# Altium project LPCB278__RLOOP__HE_THERM.PrjPCB
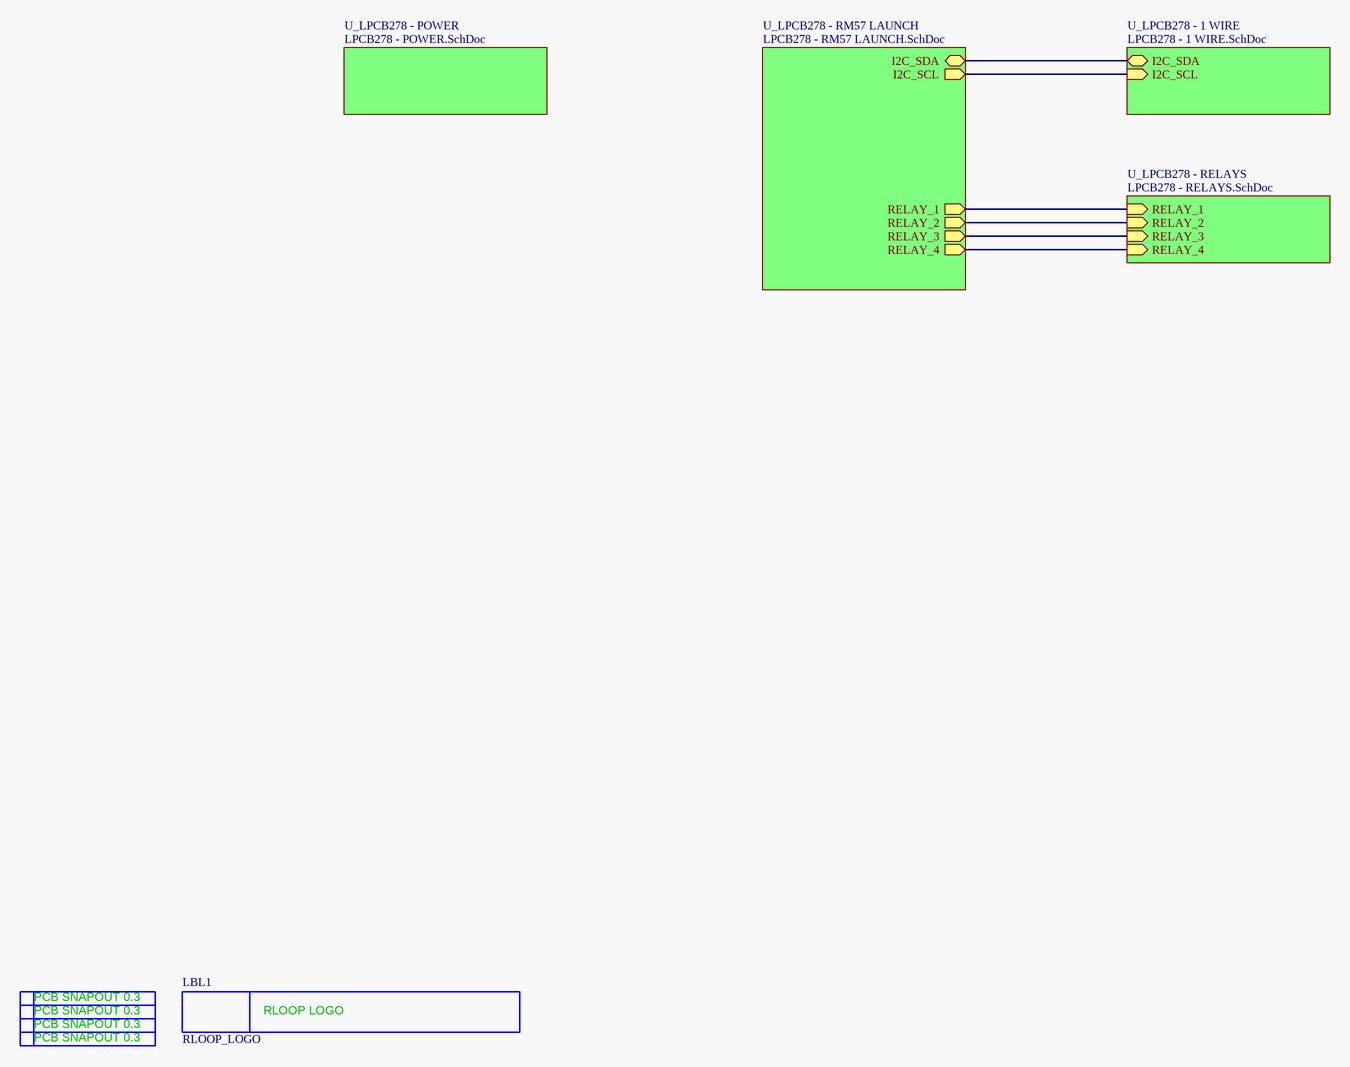
[diagram p0: LPCB278 - TOP.SchDoc]
5 sheets, 67 parts. Net scope: hierarchical (ports join the sheet entries above them; power ports are global).
Board files: LPCB278R0.PcbDoc, LPCB278R0__ASCII.PcbDoc
Sheets:
  LPCB278 - TOP.SchDoc
    U_LPCB278 - 1 WIRE = LPCB278 - 1 WIRE.SchDoc
    U_LPCB278 - POWER = LPCB278 - POWER.SchDoc
    U_LPCB278 - RM57 LAUNCH = LPCB278 - RM57 LAUNCH.SchDoc
    U_LPCB278 - RELAYS = LPCB278 - RELAYS.SchDoc

## Sheet LPCB278 - TOP.SchDoc
size A3; Address1: Factory 10; Address2: 9-13 Dingley Avenue, Dandeong, VICTORIA 3175, AUSTRALIA; DocumentNumber: 1; Revision: 1; SheetNumber: 1; SheetTotal: 5; Lockie__PCB_SUB_ASSEMBLY: PCB Sub Component; Lockie__PCB_ASSEMBLY: PCB Assembly; Lockie__LDL: LPCB278; Lockie__PCB_DESCRIPTION: HE Thermal Module

### Parts
LBL1  RLOOP_LOGO  [RLOOP_LOGO]  (no BOM)
SN1  PCB_SNAPOUT_0.3MM  [PCB_SNAPOUT_0.3MM]  (value not drawn)  (no BOM)
SN2  PCB_SNAPOUT_0.3MM  [PCB_SNAPOUT_0.3MM]  (value not drawn)  (no BOM)
SN3  PCB_SNAPOUT_0.3MM  [PCB_SNAPOUT_0.3MM]  (value not drawn)  (no BOM)
SN4  PCB_SNAPOUT_0.3MM  [PCB_SNAPOUT_0.3MM]  (value not drawn)  (no BOM)

### Sub-sheets
U_LPCB278 - 1 WIRE = LPCB278 - 1 WIRE.SchDoc: I2C_SDA (bidir), I2C_SCL (in)
U_LPCB278 - POWER = LPCB278 - POWER.SchDoc: no entries
U_LPCB278 - RELAYS = LPCB278 - RELAYS.SchDoc: RELAY_1 (in), RELAY_2 (in), RELAY_3 (in), RELAY_4 (in)
U_LPCB278 - RM57 LAUNCH = LPCB278 - RM57 LAUNCH.SchDoc: I2C_SDA (bidir), I2C_SCL (out), RELAY_1 (out), RELAY_2 (out), RELAY_3 (out), RELAY_4 (out)

### Nets
I2C_SCL: sheet U_LPCB278 - 1 WIRE/I2C_SCL, sheet U_LPCB278 - RM57 LAUNCH/I2C_SCL
I2C_SDA: sheet U_LPCB278 - 1 WIRE/I2C_SDA, sheet U_LPCB278 - RM57 LAUNCH/I2C_SDA
RELAY_1: sheet U_LPCB278 - RM57 LAUNCH/RELAY_1, sheet U_LPCB278 - RELAYS/RELAY_1
RELAY_2: sheet U_LPCB278 - RM57 LAUNCH/RELAY_2, sheet U_LPCB278 - RELAYS/RELAY_2
RELAY_3: sheet U_LPCB278 - RM57 LAUNCH/RELAY_3, sheet U_LPCB278 - RELAYS/RELAY_3
RELAY_4: sheet U_LPCB278 - RM57 LAUNCH/RELAY_4, sheet U_LPCB278 - RELAYS/RELAY_4

### Notes on the sheet
- PCB COMPONENT DESCRIPTION
- LDL NUMBER
- Assembly Details
- Size
- Drawing File Name
- Revision
- http://rloop.org
- Scale
- A3
- Sheet Details
- N.T.S
- Sheet:
- Of:
- (in symbol PCB_SNAPOUT_0.3MM) PCB SNAPOUT 0.3
- (in symbol RLOOP_LOGO) RLOOP LOGO

### Library data of the parts
LBL1 = RLOOP_LOGO: FMEDA__CHANNEL: DIAG; FMEDA__FUNCTION_IN_SYSTEM: *
SN1-SN4 = PCB_SNAPOUT_0.3MM: PCB Snapout + 0.3mm; FMEDA__CHANNEL: DIAG; FMEDA__FUNCTION_IN_SYSTEM: *

## Sheet LPCB278 - 1 WIRE.SchDoc
size A3; Address1: Factory 10; Address2: 9-13 Dingley Avenue, Dandeong, VICTORIA 3175, AUSTRALIA; DocumentNumber: 2; Revision: 1; SheetNumber: 2; SheetTotal: 5; Lockie__PCB_SUB_ASSEMBLY: PCB Sub Component; Lockie__PCB_ASSEMBLY: PCB Assembly; Lockie__LDL: LPCB278; Lockie__PCB_DESCRIPTION: HE Thermal Module
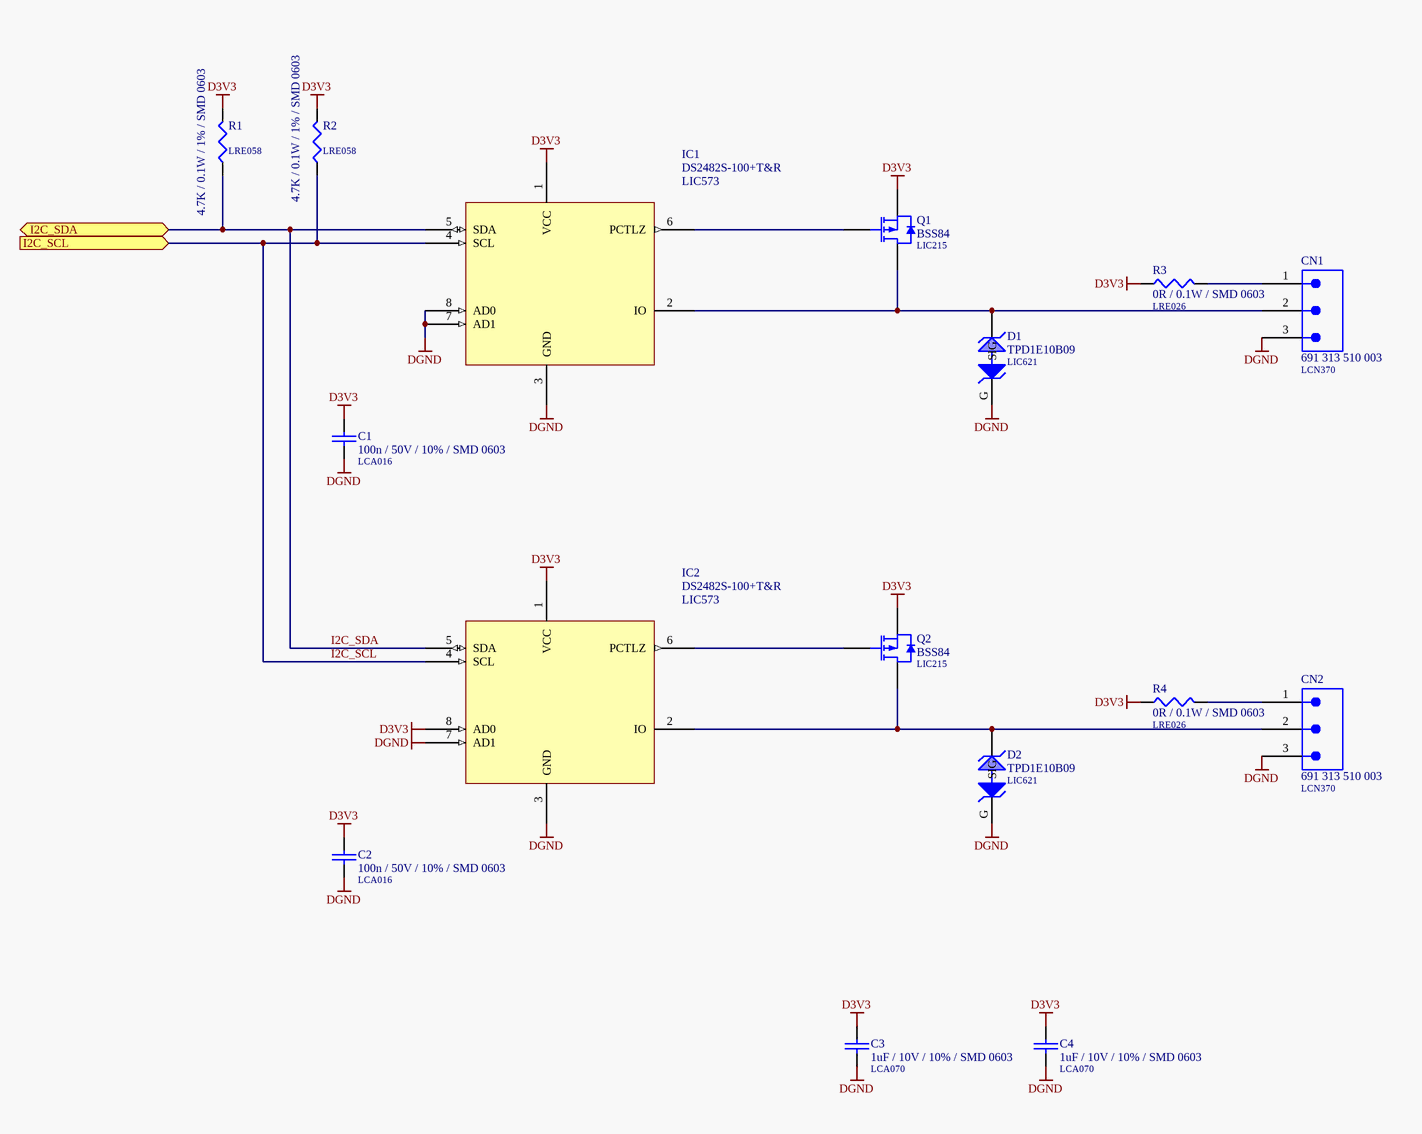
[diagram p1: LPCB278 - 1 WIRE.SchDoc]

### Parts
C1  100n / 50V / 10% / SMD 0603  LDL_NUMBER: LCA016  [LFP011__CC1608-0603-IPC7351_B]
C2  100n / 50V / 10% / SMD 0603  LDL_NUMBER: LCA016  [LFP011__CC1608-0603-IPC7351_B]
C3  1uF / 10V / 10% / SMD 0603  LDL_NUMBER: LCA070  [LFP011__CC1608-0603-IPC7351_B]
C4  1uF / 10V / 10% / SMD 0603  LDL_NUMBER: LCA070  [LFP011__CC1608-0603-IPC7351_B]
CN1  691 313 510 003  LDL_NUMBER: LCN370  [691 313 510 003]
CN2  691 313 510 003  LDL_NUMBER: LCN370  [691 313 510 003]
D1  TPD1E10B09  LDL_NUMBER: LIC621  [LFP157__R-PX1SON-N2]
D2  TPD1E10B09  LDL_NUMBER: LIC621  [LFP157__R-PX1SON-N2]
IC1  DS2482S-100+T&R  LDL_NUMBER: LIC573  [LFP069__R-8G]
IC2  DS2482S-100+T&R  LDL_NUMBER: LIC573  [LFP069__R-8G]
Q1  BSS84  LDL_NUMBER: LIC215  [LFP021__SOT23]
Q2  BSS84  LDL_NUMBER: LIC215  [LFP021__SOT23]
R1  4.7K / 0.1W / 1% / SMD 0603  LDL_NUMBER: LRE058  [LFP020__CR1608-0603-IPC7351_B]
R2  4.7K / 0.1W / 1% / SMD 0603  LDL_NUMBER: LRE058  [LFP020__CR1608-0603-IPC7351_B]
R3  0R / 0.1W / SMD 0603  LDL_NUMBER: LRE026  [LFP020__CR1608-0603-IPC7351_B]
R4  0R / 0.1W / SMD 0603  LDL_NUMBER: LRE026  [LFP020__CR1608-0603-IPC7351_B]

### Ports
I2C_SCL (in), I2C_SDA (bidir)

### Nets
D3V3: C1.1 C2.1 C3.1 C4.1 IC1.1(VCC) IC2.1(VCC) IC2.8(AD0) Q1.2(S) Q2.2(S) R1.2 R2.2 R3.1 R4.1
DGND: C1.2 C2.2 C3.2 C4.2 CN1.3 CN2.3 D1.G D2.G IC1.3(GND) IC1.7(AD1) IC1.8(AD0) IC2.3(GND) IC2.7(AD1)
I2C_SCL: IC1.4(SCL) IC2.4(SCL) R2.1 ; port I2C_SCL
I2C_SDA: IC1.5(SDA) IC2.5(SDA) R1.1 ; port I2C_SDA
NetCN1_1: CN1.1 R3.2
NetCN1_2: CN1.2 D1.2(SIG) IC1.2(IO) Q1.3(D)
NetCN2_1: CN2.1 R4.2
NetCN2_2: CN2.2 D2.2(SIG) IC2.2(IO) Q2.3(D)
NetIC1_6: IC1.6(PCTLZ) Q1.1(G)
NetIC2_6: IC2.6(PCTLZ) Q2.1(G)

### Notes on the sheet
- PCB COMPONENT DESCRIPTION
- LDL NUMBER
- Assembly Details
- Size
- Drawing File Name
- Revision
- http://rloop.org
- Scale
- A3
- Sheet Details
- N.T.S
- Sheet:
- Of:

### Library data of the parts
C1 C2 = 100n / 50V / 10% / SMD 0603: Capacitor, Ceramic Chip, 100nF (0.1uF), 50V, 5%, SMD 0603 [LCA016]; FMEDA__OPERATING__VOLTAGE_MIN: 0; FMEDA__OPERATING__VOLTAGE_MAX: 3.3; FMEDA__OPERATING__TEMP_MIN: -20; FMEDA__OPERATING__TEMP_TYP: 27; FMEDA__OPERATING__TEMP_MAX: 50; FMEDA__CHANNEL: COM; Value: 100n; FMEDA__FUNCTION_IN_SYSTEM: *; FMEDA__OPERATING__VOLTAGE_TYP: 3.3
C3 C4 = 1uF / 10V / 10% / SMD 0603: Capacitor, Ceramic Chip, 1uF, 10V, SMD 0603 [LCA070]; Value: 1u; FMEDA__OPERATING__VOLTAGE_MAX: 3.3; FMEDA__OPERATING__VOLTAGE_MIN: 0; FMEDA__OPERATING__TEMP_MAX: 50; FMEDA__OPERATING__TEMP_MIN: -20; FMEDA__OPERATING__TEMP_TYP: 27; FMEDA__CHANNEL: COM; FMEDA__OPERATING__VOLTAGE_TYP: 3.3; FMEDA__FUNCTION_IN_SYSTEM: *
CN1 CN2 = 691 313 510 003: Connector, Pluggable Terminal Block, 5.08mm, 3 Way, PTH; FMEDA__CHANNEL: COM; FMEDA__OPERATING__CURRENT_MAX: 0; FMEDA__OPERATING__TEMP_MAX: 50; FMEDA__OPERATING__TEMP_MIN: -20; FMEDA__OPERATING__TEMP_TYP: 27; FMEDA__OPERATING__VOLTAGE_MAX: 16; FMEDA__OPERATING__VOLTAGE_TYP: 12; FMEDA__FUNCTION_IN_SYSTEM: *; FMEDA__OPERATING__CURRENT_MIN: 0; FMEDA__OPERATING__CURRENT_TYP: 0; FMEDA__OPERATING__VOLTAGE_MIN: 0
D1 D2 = TPD1E10B09: Diode, ESD Protecion, 10pF, 9V Breakdown, SMD 0402 [LIC621]; FMEDA__OPERATING__TEMP_MAX: 50; FMEDA__OPERATING__TEMP_MIN: -20; FMEDA__OPERATING__TEMP_TYP: 27; FMEDA__OPERATING__VOLTAGE_MAX: 0; FMEDA__CHANNEL: COM; FMEDA__FUNCTION_IN_SYSTEM: *; FMEDA__OPERATING__VOLTAGE_MIN: 0; FMEDA__OPERATING__VOLTAGE_TYP: 0; FMEDA__OPERATING__CURRENT_MAX: 0; FMEDA__OPERATING__CURRENT_MIN: 0; FMEDA__OPERATING__CURRENT_TYP: 0
IC1 IC2 = DS2482S-100+T&R: IC, I2C to 1 Wire Bridge, SMD SOIC8
Q1 Q2 = BSS84: FET, P Channel, Logic Level, SMD SOT23 [LIC215]; FMEDA__OPERATING__TEMP_MAX: 50; FMEDA__OPERATING__TEMP_MIN: -20; FMEDA__OPERATING__TEMP_TYP: 27; FMEDA__CHANNEL: COM
R1 R2 = 4.7K / 0.1W / 1% / SMD 0603: Resistor, Ceramic Chip, 4K7, 0.1W, 1%, SMD 0603 [LRE058]; FMEDA__OPERATING__POWER_MAX: 0; FMEDA__OPERATING__TEMP_MAX: 50; FMEDA__OPERATING__TEMP_MIN: -20; FMEDA__OPERATING__TEMP_TYP: 27; FMEDA__CHANNEL: COM; VALUE: 4.7K; FMEDA__OPERATING__POWER_MIN: 0; FMEDA__OPERATING__VOLTAGE_MAX: 0; FMEDA__OPERATING__VOLTAGE_MIN: 0; FMEDA__OPERATING__VOLTAGE_TYP: 0; FMEDA__FUNCTION_IN_SYSTEM: *
R3 R4 = 0R / 0.1W / SMD 0603: Resistor, Ceramic Chip, 0R, 0.1W, SMD 0603 [LRE026]; Value: 0; FMEDA__OPERATING__TEMP_MAX: 50; FMEDA__OPERATING__TEMP_MIN: -20; FMEDA__OPERATING__TEMP_TYP: 27; FMEDA__CHANNEL: COM; FMEDA__OPERATING__POWER_MAX: 0; FMEDA__OPERATING__POWER_MIN: 0; FMEDA__OPERATING__VOLTAGE_MAX: 0; FMEDA__OPERATING__VOLTAGE_MIN: 0; FMEDA__OPERATING__VOLTAGE_TYP: 0; FMEDA__FUNCTION_IN_SYSTEM: *

## Sheet LPCB278 - POWER.SchDoc
size A3; Address1: Factory 10; Address2: 9-13 Dingley Avenue, Dandeong, VICTORIA 3175, AUSTRALIA; DocumentNumber: 3; Revision: 1; SheetNumber: 3; SheetTotal: 5; Lockie__PCB_SUB_ASSEMBLY: PCB Sub Component; Lockie__PCB_ASSEMBLY: PCB Assembly; Lockie__LDL: LPCB278; Lockie__PCB_DESCRIPTION: HE Thermal Module
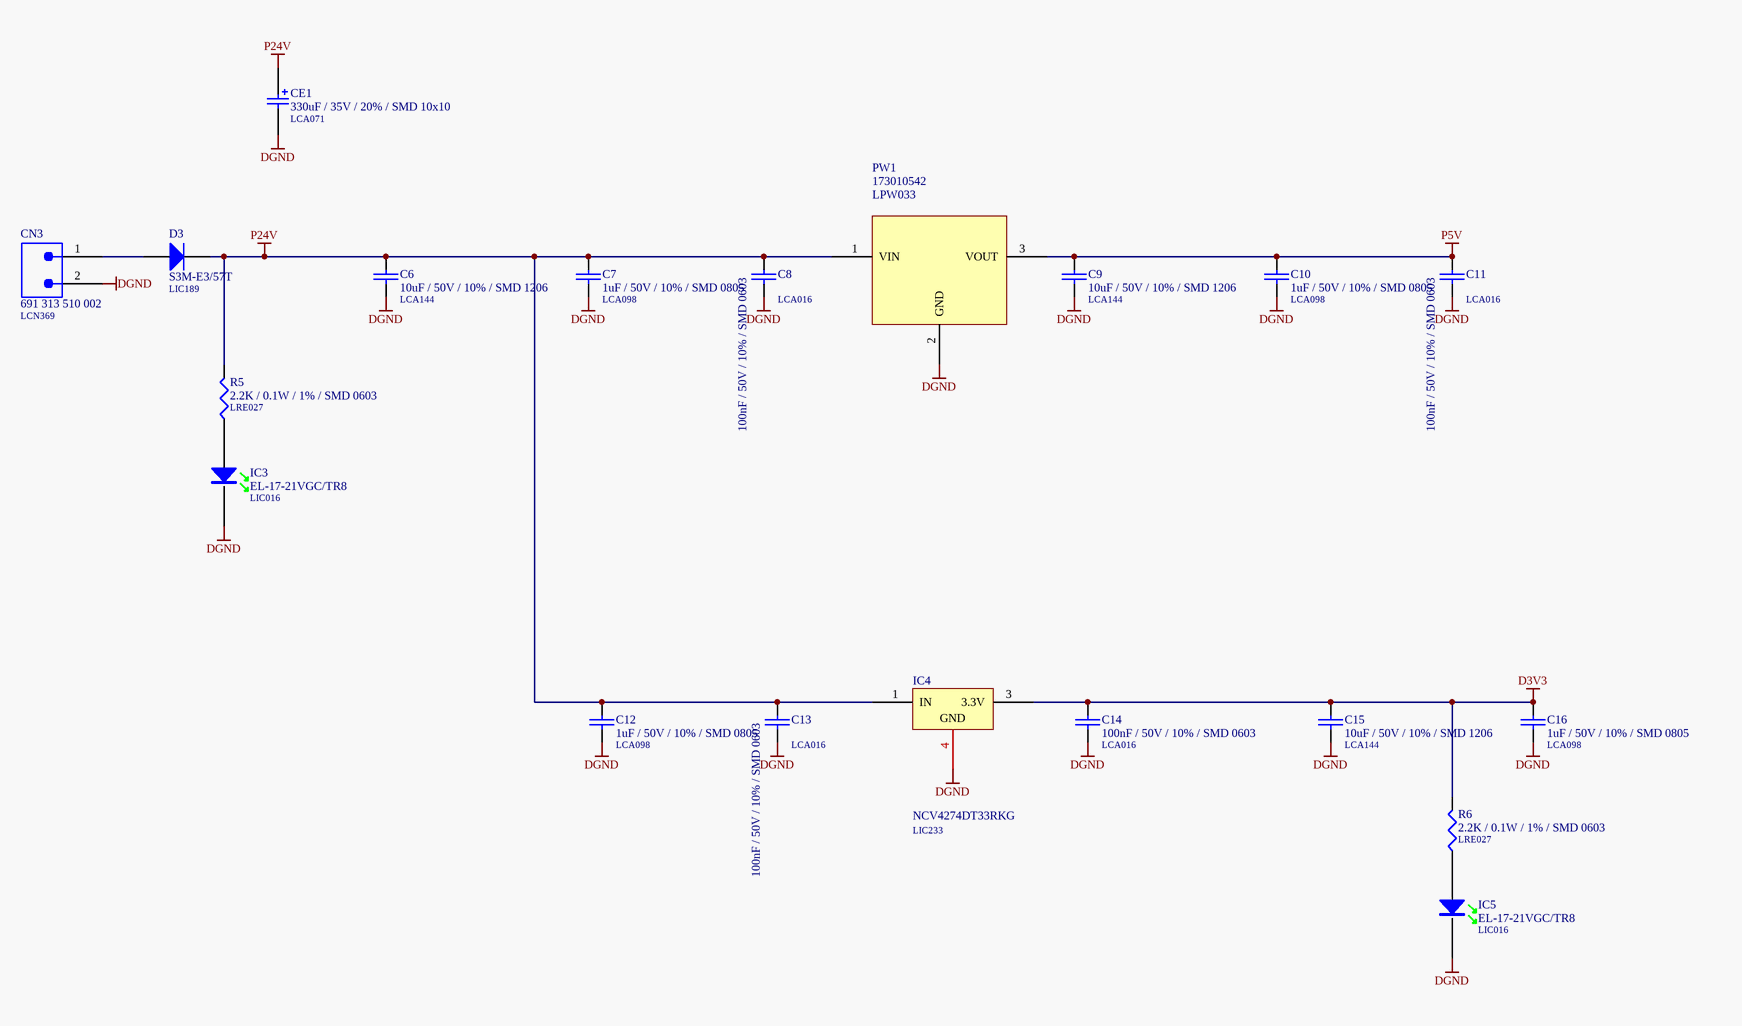
[diagram p2: LPCB278 - POWER.SchDoc]

### Parts
C6  10uF / 50V / 10% / SMD 1206  LDL_NUMBER: LCA144  [LFP043__CC3216-1206]
C7  1uF / 50V / 10% / SMD 0805  LDL_NUMBER: LCA098  [LFP010__CC2012-0805-IPC7351_B]
C8  100nF / 50V / 10% / SMD 0603  LDL_NUMBER: LCA016  [LFP011__CC1608-0603-IPC7351_B]
C9  10uF / 50V / 10% / SMD 1206  LDL_NUMBER: LCA144  [LFP043__CC3216-1206]
C10  1uF / 50V / 10% / SMD 0805  LDL_NUMBER: LCA098  [LFP010__CC2012-0805-IPC7351_B]
C11  100nF / 50V / 10% / SMD 0603  LDL_NUMBER: LCA016  [LFP011__CC1608-0603-IPC7351_B]
C12  1uF / 50V / 10% / SMD 0805  LDL_NUMBER: LCA098  [LFP010__CC2012-0805-IPC7351_B]
C13  100nF / 50V / 10% / SMD 0603  LDL_NUMBER: LCA016  [LFP011__CC1608-0603-IPC7351_B]
C14  100nF / 50V / 10% / SMD 0603  LDL_NUMBER: LCA016  [LFP011__CC1608-0603-IPC7351_B]
C15  10uF / 50V / 10% / SMD 1206  LDL_NUMBER: LCA144  [LFP043__CC3216-1206]
C16  1uF / 50V / 10% / SMD 0805  LDL_NUMBER: LCA098  [LFP010__CC2012-0805-IPC7351_B]
CE1  330uF / 35V / 20% / SMD 10x10  LDL_NUMBER: LCA071  [LFP041__NICHICON_WT_10X10]
CN3  691 313 510 002  LDL_NUMBER: LCN369  [691 313 510 002]
D3  S3M-E3/57T  LDL_NUMBER: LIC189  [LFP040__DO-214AB]
IC3  EL-17-21VGC/TR8  LDL_NUMBER: LIC016  [CR2012-0805-LED]
IC4  NCV4274DT33RKG  LDL_NUMBER: LIC233  [LFP019__369A-13]
IC5  EL-17-21VGC/TR8  LDL_NUMBER: LIC016  [CR2012-0805-LED]
PW1  173010542  LDL_NUMBER: LPW033  [173010542]
R5  2.2K / 0.1W / 1% / SMD 0603  LDL_NUMBER: LRE027  [LFP020__CR1608-0603-IPC7351_B]
R6  2.2K / 0.1W / 1% / SMD 0603  LDL_NUMBER: LRE027  [LFP020__CR1608-0603-IPC7351_B]

### Nets
D3V3: C14.1 C15.1 C16.1 IC4.3(3.3V) R6.2
DGND: C6.2 C7.2 C8.2 C9.2 C10.2 C11.2 C12.2 C13.2 C14.2 C15.2 C16.2 CE1.2 CN3.2 IC3.K IC4.4(GND) IC5.K PW1.2(GND)
P5V: C9.1 C10.1 C11.1 PW1.3(VOUT)
P24V: C6.1 C7.1 C8.1 C12.1 C13.1 CE1.1 D3.1(K) IC4.1(IN) PW1.1(VIN) R5.2
NetCN3_1: CN3.1 D3.2(A)
NetIC3_A: IC3.A R5.1
NetIC5_A: IC5.A R6.1

### Notes on the sheet
- PCB COMPONENT DESCRIPTION
- LDL NUMBER
- Assembly Details
- Size
- Drawing File Name
- Revision
- http://rloop.org
- Scale
- A3
- Sheet Details
- N.T.S
- Sheet:
- Of:

### Library data of the parts
C6 C9 C15 = 10uF / 50V / 10% / SMD 1206: Capacitor, Ceramic Chip, 10uF, 50V, X5R, 10%, SMD 1206 [LCA144]; Value: 10u; FMEDA__OPERATING__TEMP_MAX: 85; FMEDA__OPERATING__TEMP_MIN: -55; FMEDA__OPERATING__TEMP_TYP: 27; FMEDA__OPERATING__VOLTAGE_MAX: 50; FMEDA__OPERATING__VOLTAGE_MIN: 0; FMEDA__CHANNEL: COM; FMEDA__FUNCTION_IN_SYSTEM: *
C7 C10 C12 C16 = 1uF / 50V / 10% / SMD 0805: Capacitor, Ceramic Chip, 1uF, 50V, SMD 0805 [LCA098]; Value: 1u; FMEDA__OPERATING__VOLTAGE_MAX: 3.3; FMEDA__OPERATING__VOLTAGE_MIN: 0; FMEDA__OPERATING__TEMP_MAX: 50; FMEDA__OPERATING__TEMP_MIN: -20; FMEDA__OPERATING__TEMP_TYP: 27; FMEDA__CHANNEL: COM; FMEDA__OPERATING__VOLTAGE_TYP: 3.3; FMEDA__FUNCTION_IN_SYSTEM: *
C8 C11 C13 C14 = 100nF / 50V / 10% / SMD 0603: Capacitor, Ceramic Chip, 100nF (0.1uF), 50V, 5%, SMD 0603 [LCA016]; Value: 100n; FMEDA__OPERATING__VOLTAGE_MIN: 0; FMEDA__OPERATING__VOLTAGE_MAX: 3.3; FMEDA__OPERATING__TEMP_MIN: -20; FMEDA__OPERATING__TEMP_TYP: 27; FMEDA__OPERATING__TEMP_MAX: 50; FMEDA__CHANNEL: COM; FMEDA__FUNCTION_IN_SYSTEM: *; FMEDA__OPERATING__VOLTAGE_TYP: 3.3
CE1 = 330uF / 35V / 20% / SMD 10x10: Capacitor, Aluminum Electrolytic, 330uF, 35V, 20%, SMD (10mm x 10mm) [LCA071]; FMEDA__OPERATING__TEMP_MAX: 50; FMEDA__OPERATING__TEMP_MIN: -20; FMEDA__OPERATING__TEMP_TYP: 27; FMEDA__OPERATING__VOLTAGE_MAX: 0; Value: 330u; FMEDA__CHANNEL: COM; FMEDA__OPERATING__VOLTAGE_MIN: 0; FMEDA__OPERATING__VOLTAGE_TYP: 0; FMEDA__FUNCTION_IN_SYSTEM: *
CN3 = 691 313 510 002: Connector, Pluggable Terminal Block, 5.08mm, 2 Way, PTH; FMEDA__CHANNEL: COM; FMEDA__OPERATING__CURRENT_MAX: 0; FMEDA__OPERATING__TEMP_MAX: 50; FMEDA__OPERATING__TEMP_MIN: -20; FMEDA__OPERATING__TEMP_TYP: 27; FMEDA__OPERATING__VOLTAGE_MAX: 16; FMEDA__OPERATING__VOLTAGE_TYP: 12; FMEDA__FUNCTION_IN_SYSTEM: *; FMEDA__OPERATING__CURRENT_MIN: 0; FMEDA__OPERATING__CURRENT_TYP: 0; FMEDA__OPERATING__VOLTAGE_MIN: 0
D3 = S3M-E3/57T: Diode, General Purpose Rectifier, 3A, 200V, SMD DO-214AB [LIC189]; FMEDA__OPERATING__CURRENT_MAX: 0; FMEDA__OPERATING__TEMP_MAX: 50; FMEDA__OPERATING__TEMP_MIN: -20; FMEDA__OPERATING__TEMP_TYP: 27; FMEDA__CHANNEL: COM; FMEDA__OPERATING__CURRENT_MIN: 0; FMEDA__OPERATING__CURRENT_TYP: 0; FMEDA__OPERATING__VOLTAGE_MAX: 0; FMEDA__OPERATING__VOLTAGE_MIN: 0; FMEDA__OPERATING__VOLTAGE_TYP: 0; FMEDA__FUNCTION_IN_SYSTEM: *
IC3 IC5 = EL-17-21VGC/TR8: LED, SMD, 0805 Green [LIC016]; FMEDA__OPERATING__TEMP_MAX: 50; FMEDA__OPERATING__TEMP_MIN: -20; FMEDA__OPERATING__TEMP_TYP: 27; FMEDA__CHANNEL: COM; FMEDA__FUNCTION_IN_SYSTEM: *
IC4 = NCV4274DT33RKG: IC, Voltage Regulator, 400mA, 3.3V LDO, SMD DPAK [LIC233]; FMEDA__OPERATING__OUTPUT_CURRENT_MIN: 0; FMEDA__OPERATING__TEMP_MAX: 50; FMEDA__OPERATING__TEMP_MIN: -20; FMEDA__OPERATING__TEMP_TYP: 27; VALUE: 0; Note: Obey Thermal Design Rules; FMEDA__CHANNEL: COM; FMEDA__OPERATING__OUTPUT_CURRENT_TYP: 0; FMEDA__OPERATING__VOLTAGE_MAX: 0; FMEDA__OPERATING__VOLTAGE_MIN: 0; FMEDA__OPERATING__VOLTAGE_TYP: 0; FMEDA__FUNCTION_IN_SYSTEM: *
R5 R6 = 2.2K / 0.1W / 1% / SMD 0603: Resistor, Ceramic Chip, 2.2K, 0.1W, 1%, SMD 0603 [LRE027]; FMEDA__OPERATING__VOLTAGE_MIN: 0; FMEDA__OPERATING__TEMP_MIN: -20; FMEDA__OPERATING__TEMP_TYP: 27; FMEDA__OPERATING__TEMP_MAX: 50; FMEDA__CHANNEL: COM; VALUE: 2.2K; FMEDA__OPERATING__VOLTAGE_MAX: 0; FMEDA__OPERATING__POWER_MIN: 0; FMEDA__OPERATING__POWER_MAX: 0; FMEDA__FUNCTION_IN_SYSTEM: *; FMEDA__OPERATING__VOLTAGE_TYP: 0

## Sheet LPCB278 - RM57 LAUNCH.SchDoc
size A3; Address1: Factory 10; Address2: 9-13 Dingley Avenue, Dandeong, VICTORIA 3175, AUSTRALIA; DocumentNumber: 5; Revision: 1; SheetNumber: 5; SheetTotal: 5; Lockie__PCB_SUB_ASSEMBLY: PCB Sub Component; Lockie__PCB_ASSEMBLY: PCB Assembly; Lockie__LDL: LPCB278; Lockie__PCB_DESCRIPTION: HE Thermal Module
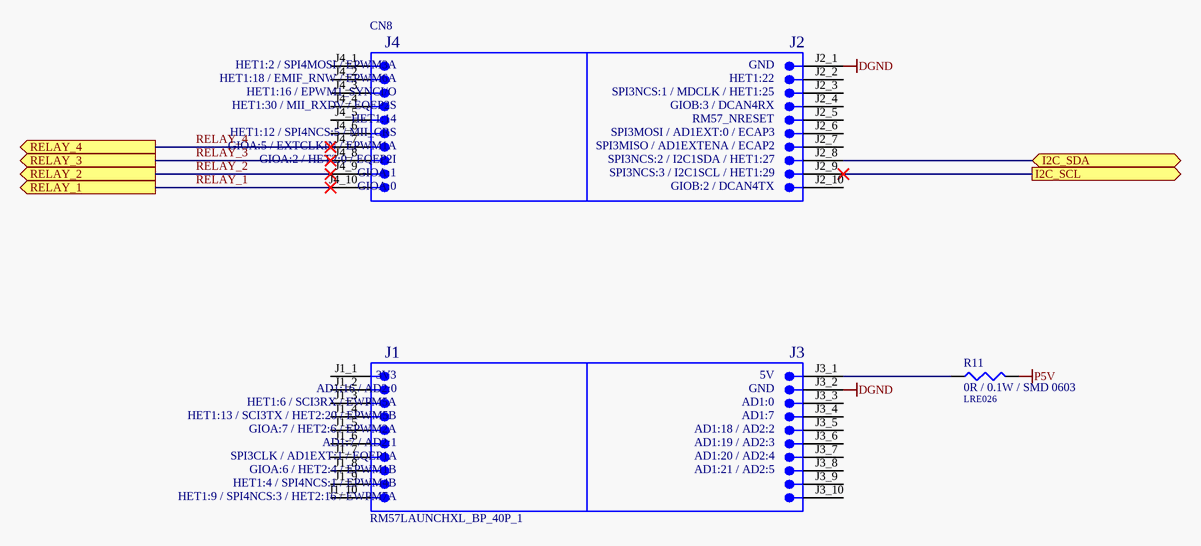
[diagram p3: LPCB278 - RM57 LAUNCH.SchDoc]

### Parts
CN8  RM57LAUNCHXL_BP_40P_1  [RM57LAUNCHXL_BP_40P_1]  (no BOM)
R11  0R / 0.1W / SMD 0603  LDL_NUMBER: LRE026  [LFP020__CR1608-0603-IPC7351_B]

### Ports
I2C_SCL (out), I2C_SDA (bidir), RELAY_1 (out), RELAY_2 (out), RELAY_3 (out), RELAY_4 (out)

### Nets
DGND: CN8.J2_1 CN8.J3_2
P5V: R11.2
I2C_SCL: CN8.J2_9 ; port I2C_SCL
I2C_SDA: CN8.J2_8 ; port I2C_SDA
RELAY_1: CN8.J4_10 ; port RELAY_1
RELAY_2: CN8.J4_9 ; port RELAY_2
RELAY_3: CN8.J4_8 ; port RELAY_3
RELAY_4: CN8.J4_7 ; port RELAY_4
NetCN8_J3_1: CN8.J3_1 R11.1

Not connected (* = marked no-connect by the designer): CN8 J1_1 J1_2 J1_3 J1_4 J1_5 J1_6 J1_7 J1_8 J1_9 J1_10 J2_2 J2_3 J2_4 J2_5 J2_6 J2_7 J2_10 J3_3 J3_4 J3_5 J3_6 J3_7 J3_8 J3_9 J3_10 J4_1 J4_2 J4_3 J4_4 J4_5 J4_6

### Notes on the sheet
- PCB COMPONENT DESCRIPTION
- LDL NUMBER
- Assembly Details
- Size
- Drawing File Name
- Revision
- http://rloop.org
- Scale
- A3
- Sheet Details
- N.T.S
- Sheet:
- Of:
- (in symbol RM57LAUNCHXL_BP_40P_1) J4; J2; HET1:2 / SPI4MOSI / EPWM3A; GND; HET1:18 / EMIF_RNW / EPWM6A; HET1:22; HET1:16 / EPWM1_SYNCI/O; SPI3NCS:1 / MDCLK / HET1:25; HET1:30 / MII_RXDV / EQEP2S; GIOB:3 / DCAN4RX; HET1:14; RM57_NRESET; HET1:12 / SPI4NCS:5 / MII_CRS; SPI3MOSI / AD1EXT:0 / ECAP3; GIOA:5 / EXTCLKIN / EPWM1A; SPI3MISO / AD1EXTENA / ECAP2; GIOA:2 / HET2:0 / EQEP2I; SPI3NCS:2 / I2C1SDA / HET1:27; GIOA:1; SPI3NCS:3 / I2C1SCL / HET1:29; GIOA:0; GIOB:2 / DCAN4TX; J1; J3; 3V3; 5V; AD1:16 / AD2:0; HET1:6 / SCI3RX / EWPM5A; AD1:0; HET1:13 / SCI3TX / HET2:20 / EPWM5B; AD1:7; GIOA:7 / HET2:6 / EPWM2A; AD1:18 / AD2:2; AD1:7 / AD2:1; AD1:19 / AD2:3; SPI3CLK / AD1EXT:1 / EQEP1A; AD1:20 / AD2:4; GIOA:6 / HET2:4 / EPWM1B; AD1:21 / AD2:5; HET1:4 / SPI4NCS:1 / EPWM4B; HET1:9 / SPI4NCS:3 / HET2:16 / EWPM7A

### Library data of the parts
CN8 = RM57LAUNCHXL_BP_40P_1: Connector, RM57L843 LaunchXL, 40Pin Boosterpack Site1; FMEDA__CHANNEL: COM; FMEDA__OPERATING__CURRENT_MAX: 0; FMEDA__OPERATING__TEMP_MAX: 50; FMEDA__OPERATING__TEMP_MIN: -20; FMEDA__OPERATING__TEMP_TYP: 27; FMEDA__OPERATING__VOLTAGE_MAX: 16; FMEDA__OPERATING__VOLTAGE_TYP: 12; FMEDA__FUNCTION_IN_SYSTEM: *; FMEDA__OPERATING__CURRENT_MIN: 0; FMEDA__OPERATING__CURRENT_TYP: 0; FMEDA__OPERATING__VOLTAGE_MIN: 0
R11 = 0R / 0.1W / SMD 0603: as R3 on sheet LPCB278 - 1 WIRE; FMEDA__OPERATING__POWER_MAX: 0; FMEDA__OPERATING__POWER_MIN: 0; FMEDA__OPERATING__VOLTAGE_MAX: 0; FMEDA__OPERATING__VOLTAGE_MIN: 0; FMEDA__OPERATING__VOLTAGE_TYP: 0; FMEDA__FUNCTION_IN_SYSTEM: *

## Sheet LPCB278 - RELAYS.SchDoc
size A3; Address1: Factory 10; Address2: 9-13 Dingley Avenue, Dandeong, VICTORIA 3175, AUSTRALIA; DocumentNumber: 4; Revision: 1; SheetNumber: 4; SheetTotal: 5; Lockie__PCB_SUB_ASSEMBLY: PCB Sub Component; Lockie__PCB_ASSEMBLY: PCB Assembly; Lockie__LDL: LPCB278; Lockie__PCB_DESCRIPTION: HE Thermal Module
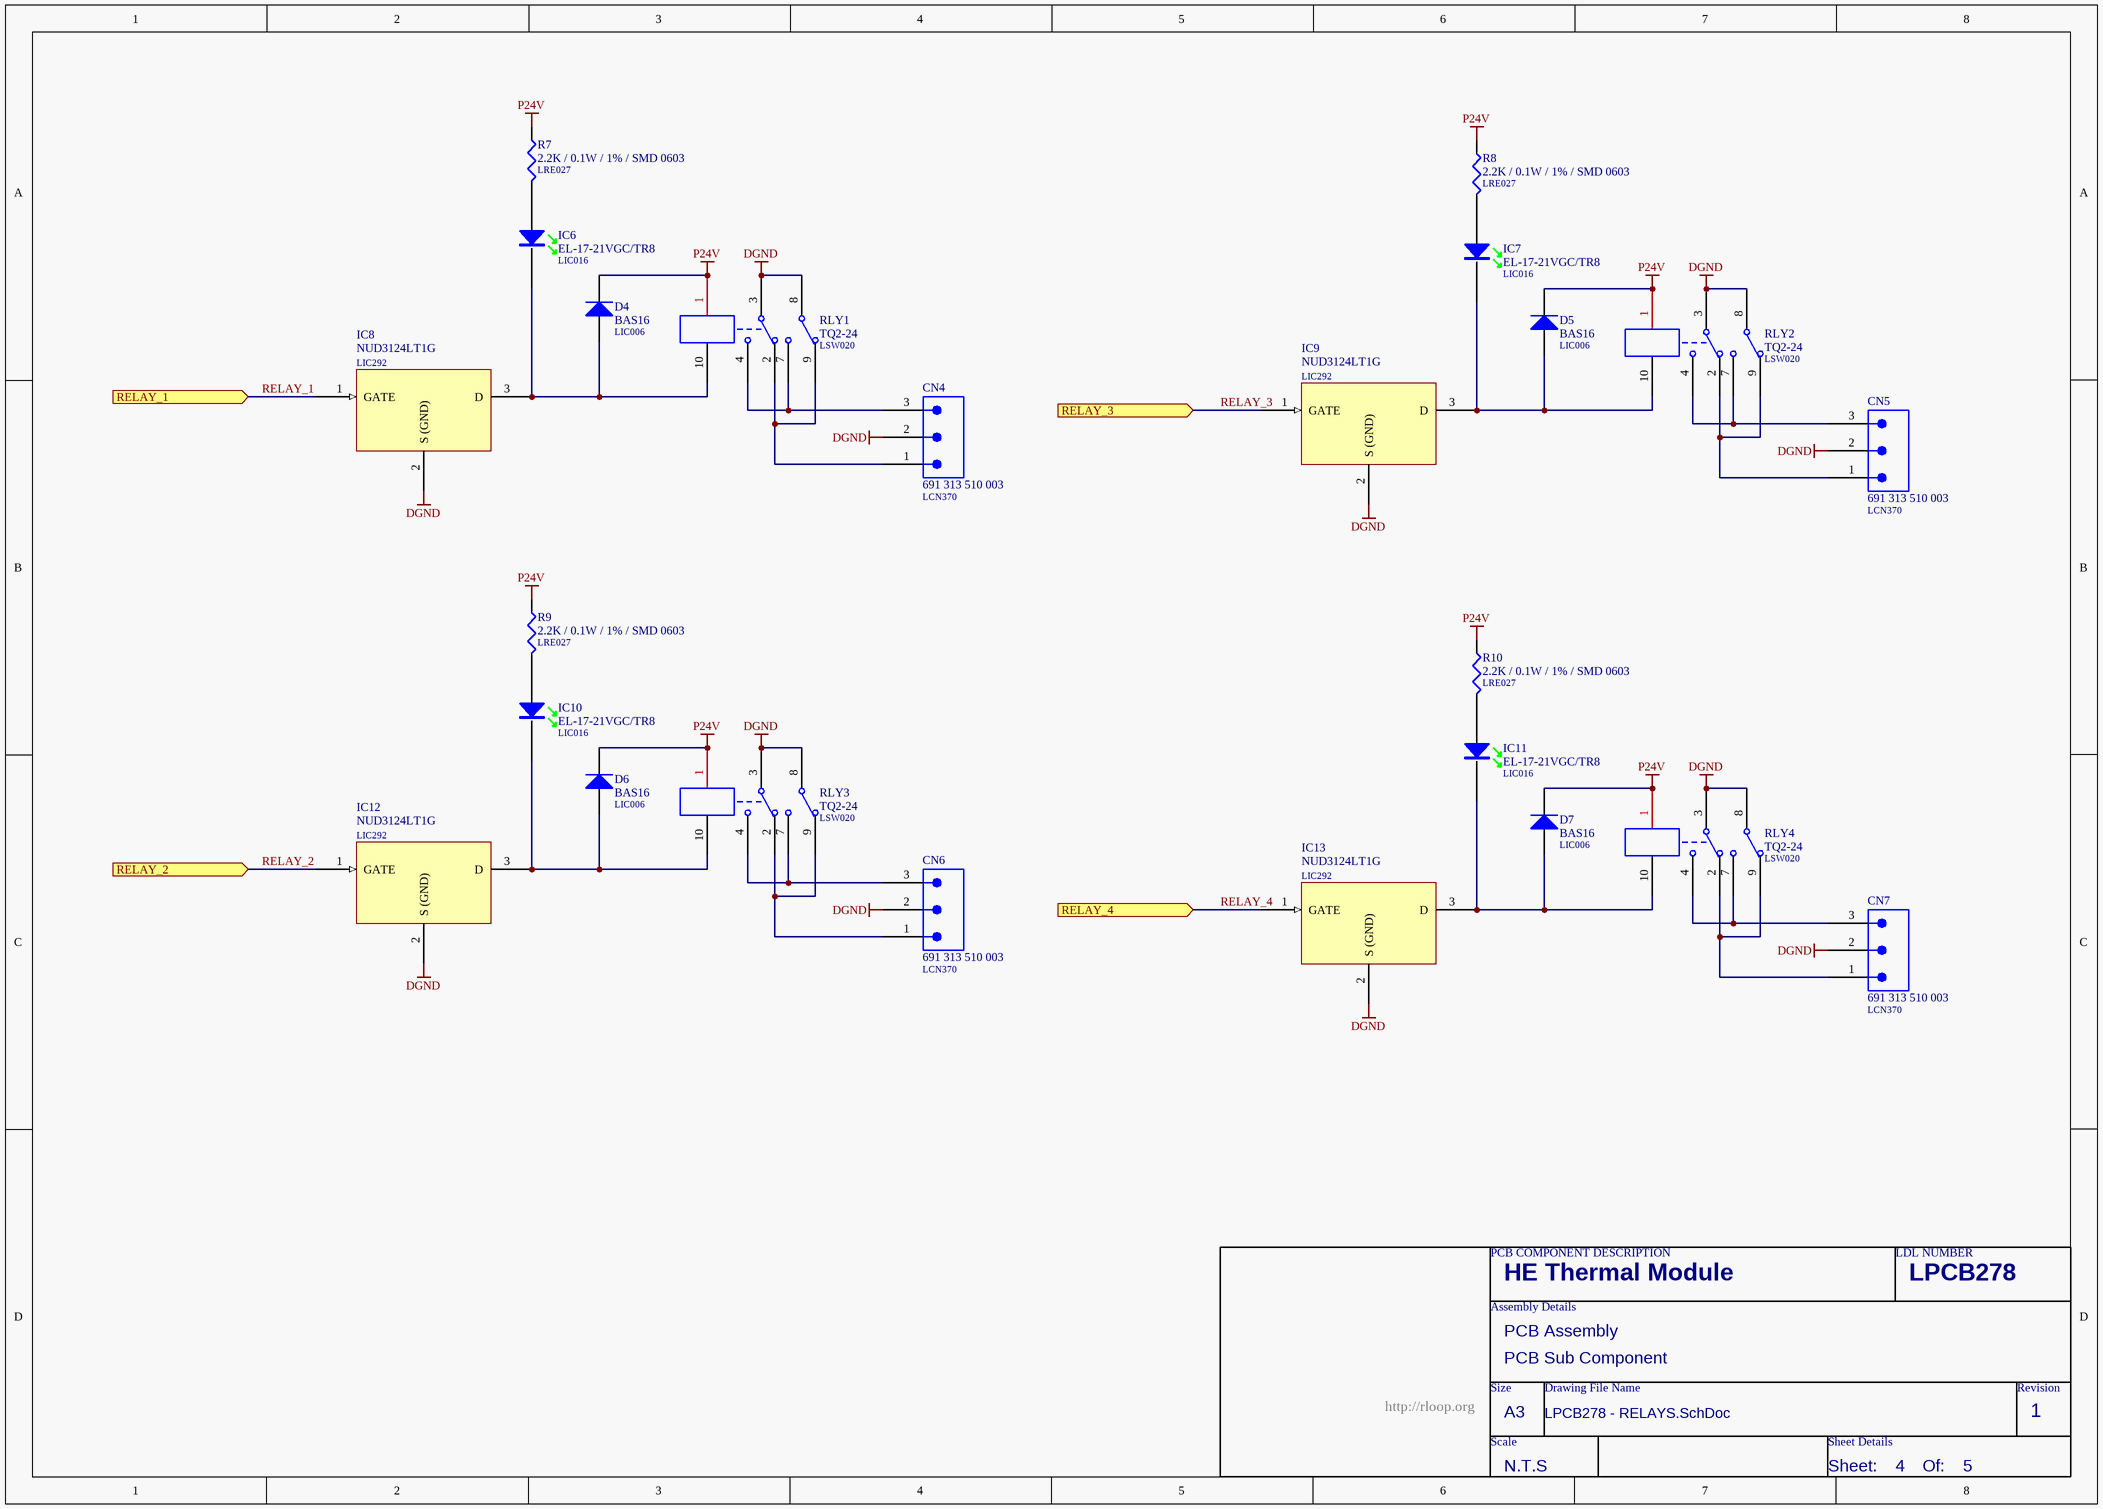
[diagram p4: LPCB278 - RELAYS.SchDoc]

### Parts
CN4  691 313 510 003  LDL_NUMBER: LCN370  [691 313 510 003]
CN5  691 313 510 003  LDL_NUMBER: LCN370  [691 313 510 003]
CN6  691 313 510 003  LDL_NUMBER: LCN370  [691 313 510 003]
CN7  691 313 510 003  LDL_NUMBER: LCN370  [691 313 510 003]
D4  BAS16  LDL_NUMBER: LIC006  [LFP021__SOT23]
D5  BAS16  LDL_NUMBER: LIC006  [LFP021__SOT23]
D6  BAS16  LDL_NUMBER: LIC006  [LFP021__SOT23]
D7  BAS16  LDL_NUMBER: LIC006  [LFP021__SOT23]
IC6  EL-17-21VGC/TR8  LDL_NUMBER: LIC016  [CR2012-0805-LED]
IC7  EL-17-21VGC/TR8  LDL_NUMBER: LIC016  [CR2012-0805-LED]
IC8  NUD3124LT1G  LDL_NUMBER: LIC292  [LFP021__SOT23]
IC9  NUD3124LT1G  LDL_NUMBER: LIC292  [LFP021__SOT23]
IC10  EL-17-21VGC/TR8  LDL_NUMBER: LIC016  [CR2012-0805-LED]
IC11  EL-17-21VGC/TR8  LDL_NUMBER: LIC016  [CR2012-0805-LED]
IC12  NUD3124LT1G  LDL_NUMBER: LIC292  [LFP021__SOT23]
IC13  NUD3124LT1G  LDL_NUMBER: LIC292  [LFP021__SOT23]
R7  2.2K / 0.1W / 1% / SMD 0603  LDL_NUMBER: LRE027  [LFP020__CR1608-0603-IPC7351_B]
R8  2.2K / 0.1W / 1% / SMD 0603  LDL_NUMBER: LRE027  [LFP020__CR1608-0603-IPC7351_B]
R9  2.2K / 0.1W / 1% / SMD 0603  LDL_NUMBER: LRE027  [LFP020__CR1608-0603-IPC7351_B]
R10  2.2K / 0.1W / 1% / SMD 0603  LDL_NUMBER: LRE027  [LFP020__CR1608-0603-IPC7351_B]
RLY1  TQ2-24  LDL_NUMBER: LSW020  [TQ2]
RLY2  TQ2-24  LDL_NUMBER: LSW020  [TQ2]
RLY3  TQ2-24  LDL_NUMBER: LSW020  [TQ2]
RLY4  TQ2-24  LDL_NUMBER: LSW020  [TQ2]

### Ports
RELAY_1 (in), RELAY_2 (in), RELAY_3 (in), RELAY_4 (in)

### Nets
DGND: CN4.2 CN5.2 CN6.2 CN7.2 IC8.2(S_(GND)) IC9.2(S_(GND)) IC12.2(S_(GND)) IC13.2(S_(GND)) RLY1.3 RLY1.8 RLY2.3 RLY2.8 RLY3.3 RLY3.8 RLY4.3 RLY4.8
P24V: D4.3(K) D5.3(K) D6.3(K) D7.3(K) R7.1 R8.1 R9.1 R10.1 RLY1.1 RLY2.1 RLY3.1 RLY4.1
RELAY_1: IC8.1(GATE) ; port RELAY_1
RELAY_2: IC12.1(GATE) ; port RELAY_2
RELAY_3: IC9.1(GATE) ; port RELAY_3
RELAY_4: IC13.1(GATE) ; port RELAY_4
NetCN4_1: CN4.1 RLY1.2 RLY1.9
NetCN4_3: CN4.3 RLY1.4 RLY1.7
NetCN5_1: CN5.1 RLY2.2 RLY2.9
NetCN5_3: CN5.3 RLY2.4 RLY2.7
NetCN6_1: CN6.1 RLY3.2 RLY3.9
NetCN6_3: CN6.3 RLY3.4 RLY3.7
NetCN7_1: CN7.1 RLY4.2 RLY4.9
NetCN7_3: CN7.3 RLY4.4 RLY4.7
NetD4_1: D4.1(A) IC6.K IC8.3(D) RLY1.10
NetD5_1: D5.1(A) IC7.K IC9.3(D) RLY2.10
NetD6_1: D6.1(A) IC10.K IC12.3(D) RLY3.10
NetD7_1: D7.1(A) IC11.K IC13.3(D) RLY4.10
NetIC6_A: IC6.A R7.2
NetIC7_A: IC7.A R8.2
NetIC10_A: IC10.A R9.2
NetIC11_A: IC11.A R10.2

### Notes on the sheet
- PCB COMPONENT DESCRIPTION
- LDL NUMBER
- Assembly Details
- Size
- Drawing File Name
- Revision
- http://rloop.org
- Scale
- A3
- Sheet Details
- N.T.S
- Sheet:
- Of:

### Library data of the parts
CN4-CN7 = 691 313 510 003: as CN1 on sheet LPCB278 - 1 WIRE; FMEDA__FUNCTION_IN_SYSTEM: *; FMEDA__OPERATING__CURRENT_MIN: 0; FMEDA__OPERATING__CURRENT_TYP: 0; FMEDA__OPERATING__VOLTAGE_MIN: 0
D4-D7 = BAS16: Diode, Small Signal, 0.2A, 85V, SMD SOT-23 [LIC006]; FMEDA__OPERATING__CURRENT_MIN: 0; FMEDA__OPERATING__TEMP_MIN: -20; FMEDA__OPERATING__TEMP_TYP: 27; FMEDA__OPERATING__TEMP_MAX: 50; FMEDA__CHANNEL: COM; FMEDA__OPERATING__CURRENT_MAX: 0; FMEDA__OPERATING__VOLTAGE_MIN: 0; FMEDA__OPERATING__VOLTAGE_MAX: 0; FMEDA__FUNCTION_IN_SYSTEM: *; FMEDA__OPERATING__CURRENT_TYP: 0; FMEDA__OPERATING__VOLTAGE_TYP: 0
IC6 IC7 IC10 IC11 = EL-17-21VGC/TR8: as IC3 on sheet LPCB278 - POWER; FMEDA__FUNCTION_IN_SYSTEM: *
IC8 IC9 IC12 IC13 = NUD3124LT1G: IC, Relay Driver, 28V Industrial, SMD SOT23 [LIC292]; FMEDA__OPERATING__TEMP_MIN: -20; FMEDA__OPERATING__TEMP_TYP: 27; FMEDA__OPERATING__TEMP_MAX: 50; FMEDA__OPERATING__VOLTAGE_MIN: 0; FMEDA__OPERATING__VOLTAGE_TYP: 13; FMEDA__OPERATING__VOLTAGE_MAX: 18; FMEDA__OPERATING__POWER_TYP: 0.1; FMEDA__OPERATING__POWER_MAX: 0.15; FMEDA__CHANNEL: COM; FMEDA__FUNCTION_IN_SYSTEM: *; FMEDA__OPERATING__POWER_MIN: 0
R7-R10 = 2.2K / 0.1W / 1% / SMD 0603: as R5 on sheet LPCB278 - POWER; VALUE: 2.2K; FMEDA__OPERATING__VOLTAGE_MAX: 0; FMEDA__OPERATING__POWER_MIN: 0; FMEDA__OPERATING__POWER_MAX: 0; FMEDA__FUNCTION_IN_SYSTEM: *; FMEDA__OPERATING__VOLTAGE_TYP: 0
RLY1-RLY4 = TQ2-24: Relay, DPDT, Non Latching, 24VDC Coil, 1A Rating, PTH; FMEDA__CHANNEL: COM; FMEDA__OPERATING__TEMP_MAX: 50; FMEDA__OPERATING__TEMP_MIN: -20; FMEDA__OPERATING__TEMP_TYP: 27; Revision: July-2002: Re-released for DXP Platform.; FMEDA__FUNCTION_IN_SYSTEM: *

## Nets that join several sheets
D3V3: LPCB278 - 1 WIRE (13 pins), LPCB278 - POWER (5 pins)
DGND: LPCB278 - 1 WIRE (13 pins), LPCB278 - POWER (17 pins), LPCB278 - RM57 LAUNCH (CN8.J2_1 CN8.J3_2), LPCB278 - RELAYS (16 pins)
P5V: LPCB278 - POWER (C9.1 C10.1 C11.1 PW1.3), LPCB278 - RM57 LAUNCH (R11.2)
P24V: LPCB278 - POWER (10 pins), LPCB278 - RELAYS (12 pins)
I2C_SCL: LPCB278 - 1 WIRE (IC1.4 IC2.4 R2.1), LPCB278 - RM57 LAUNCH (CN8.J2_9)
I2C_SDA: LPCB278 - 1 WIRE (IC1.5 IC2.5 R1.1), LPCB278 - RM57 LAUNCH (CN8.J2_8)
RELAY_1: LPCB278 - RM57 LAUNCH (CN8.J4_10), LPCB278 - RELAYS (IC8.1)
RELAY_2: LPCB278 - RM57 LAUNCH (CN8.J4_9), LPCB278 - RELAYS (IC12.1)
RELAY_3: LPCB278 - RM57 LAUNCH (CN8.J4_8), LPCB278 - RELAYS (IC9.1)
RELAY_4: LPCB278 - RM57 LAUNCH (CN8.J4_7), LPCB278 - RELAYS (IC13.1)